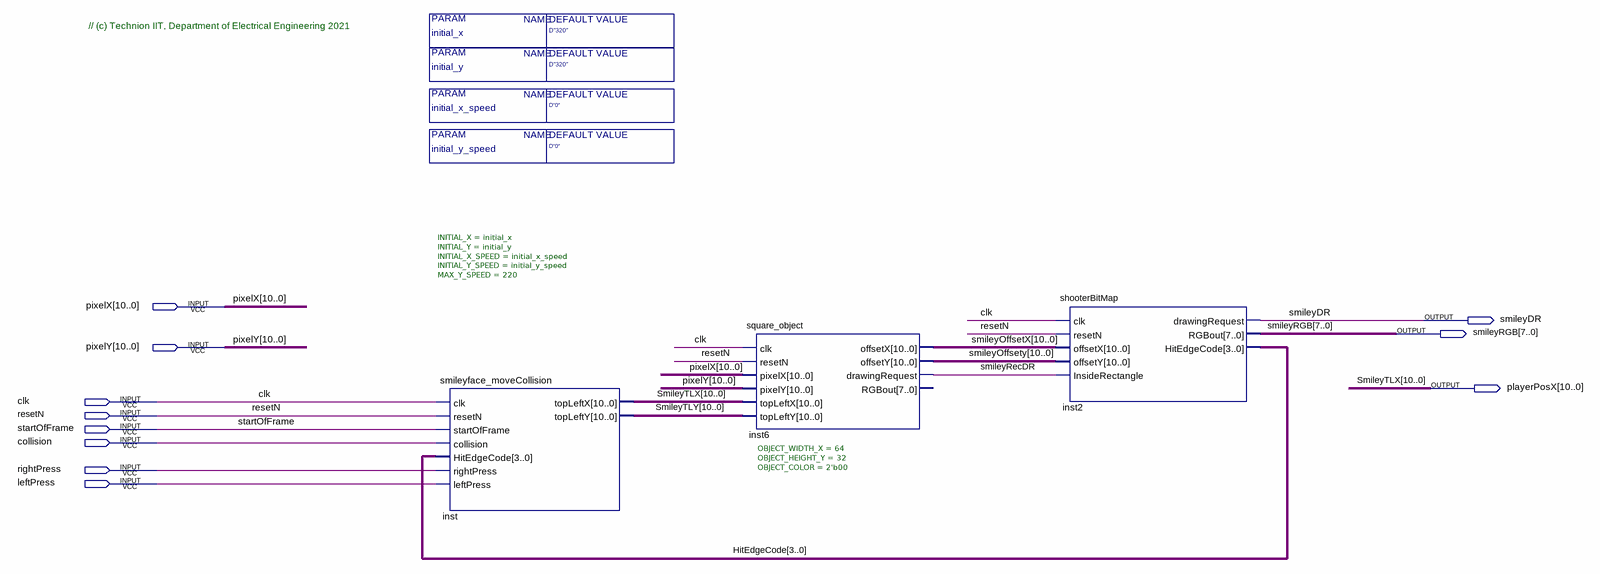
[diagram p0: schematic sheet]
// Quartus schematic Smiley_Block.bdf as structural Verilog: 3 symbols, 11 pins
module Smiley_Block #(parameter initial_x_speed = "D\"0\"", parameter initial_y = "D\"320\"", parameter initial_x = "D\"320\"", parameter initial_y_speed = "D\"0\"") (
  input  [10:0] pixelX,
  input  [10:0] pixelY,
  input  clk,
  input  resetN,
  input  startOfFrame,
  input  collision,
  input  rightPress,
  input  leftPress,
  output smileyDR,
  output [7:0] smileyRGB,
  output [10:0] playerPosX
);

  wire smileyRecDR;
  wire [3:0] HitEdgeCode;
  wire [10:0] smileyOffsetX, smileyOffsety, SmileyTLY;

  smileyface_moveCollision #(.INITIAL_X(initial_x), .INITIAL_Y(initial_y), .INITIAL_X_SPEED(initial_x_speed), .INITIAL_Y_SPEED(initial_y_speed), .MAX_Y_SPEED(220)) inst (
    .clk(clk), .resetN(resetN), .startOfFrame(startOfFrame), .collision(collision),
    .HitEdgeCode(HitEdgeCode), .rightPress(rightPress), .leftPress(leftPress), .topLeftX(playerPosX),
    .topLeftY(SmileyTLY));
  square_object #(.OBJECT_WIDTH_X(64), .OBJECT_HEIGHT_Y(32), .OBJECT_COLOR(2'b00)) inst6 (
    .clk(clk), .resetN(resetN), .pixelX(pixelX), .pixelY(pixelY), .topLeftX(playerPosX),
    .topLeftY(SmileyTLY), .offsetX(smileyOffsetX), .offsetY(smileyOffsety), .drawingRequest(smileyRecDR));  // open: RGBout
  shooterBitMap inst2 (
    .clk(clk), .resetN(resetN), .offsetX(smileyOffsetX), .offsetY(smileyOffsety),
    .InsideRectangle(smileyRecDR), .drawingRequest(smileyDR), .RGBout(smileyRGB), .HitEdgeCode(HitEdgeCode));

  // Other names for the same wires on the sheet: SmileyTLX[10:0] = playerPosX

  // Notes on the sheet:
  //   // (c) Technion IIT, Department of Electrical Engineering 2021
endmodule
